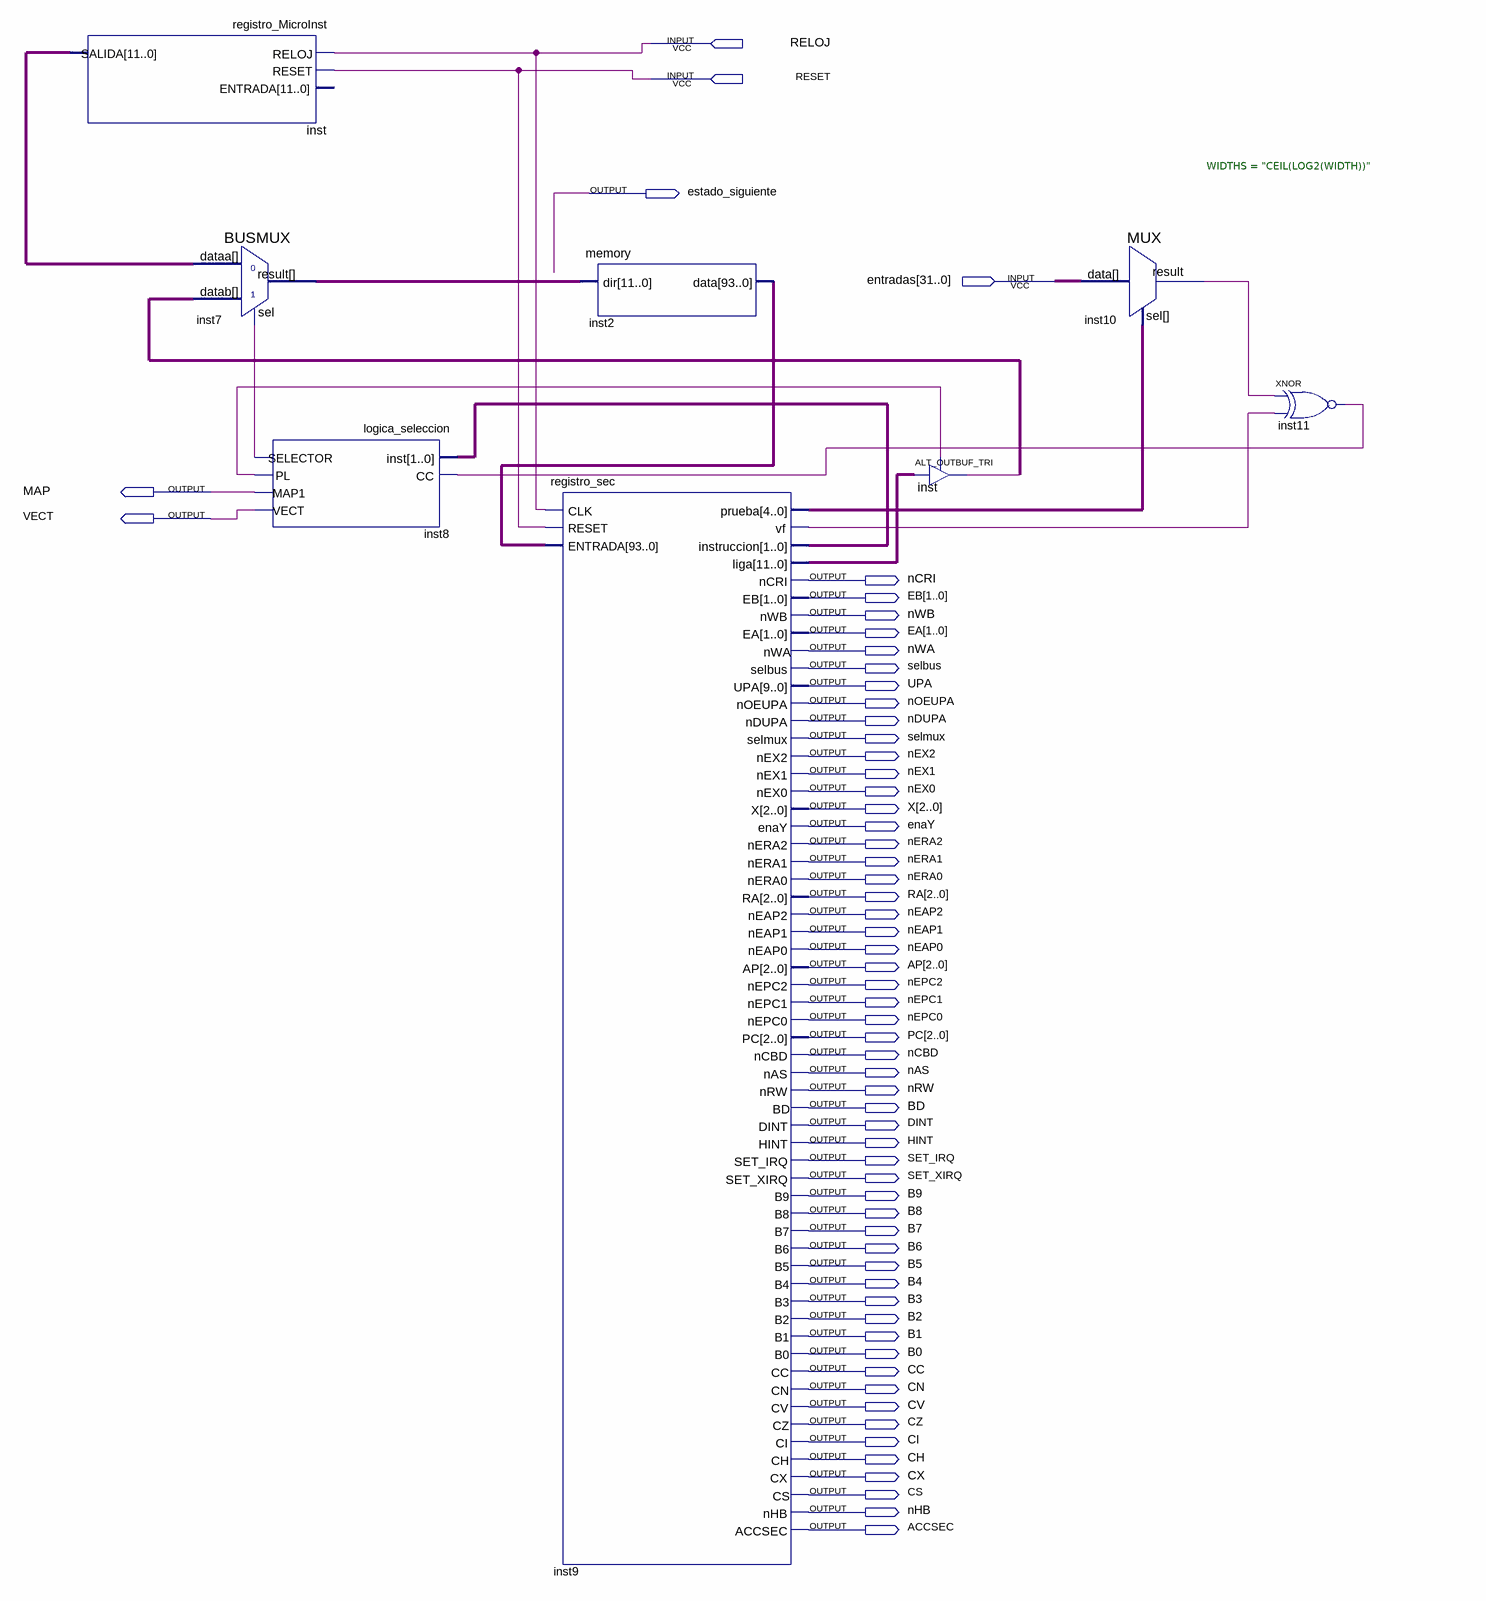
[diagram p0: schematic sheet]
// Quartus schematic secuenciador_basico.bdf as structural Verilog: 8 symbols, 61 pins
module secuenciador_basico (
  input  RELOJ,
  input  RESET,
  input  [31:0] entradas,
  output estado_siguiente,
  output MAP,
  output VECT,
  output nCRI,
  output [1:0] EB,
  output nWB,
  output [1:0] EA,
  output nWA,
  output selbus,
  output UPA,
  output nOEUPA,
  output nDUPA,
  output selmux,
  output nEX2,
  output nEX1,
  output nEX0,
  output [2:0] X,
  output enaY,
  output nERA2,
  output nERA1,
  output nERA0,
  output [2:0] RA,
  output nEAP2,
  output nEAP1,
  output nEAP0,
  output [2:0] AP,
  output nEPC2,
  output nEPC1,
  output nEPC0,
  output [2:0] PC,
  output nCBD,
  output nAS,
  output nRW,
  output BD,
  output DINT,
  output HINT,
  output SET_IRQ,
  output SET_XIRQ,
  output B9,
  output B8,
  output B7,
  output B6,
  output B5,
  output B4,
  output B3,
  output B2,
  output B1,
  output B0,
  output CC,
  output CN,
  output CV,
  output CZ,
  output CI,
  output CH,
  output CX,
  output CS,
  output nHB,
  output ACCSEC
);

  wire inst8_pl, inst8_selector, inst9_vf, inst10_result, inst11_out, inst_o;
  wire [1:0] inst9_instruccion;
  wire [4:0] inst9_prueba;
  wire [11:0] inst7_result, inst9_liga, inst_salida;
  wire [93:0] inst2_data;

  registro_MicroInst inst (.RELOJ(RELOJ), .RESET(RESET), .SALIDA(inst_salida));  // open: ENTRADA
  BUSMUX inst7 (.datab(inst_o), .sel(inst8_selector), .dataa(inst_salida), .result(inst7_result));
  logica_seleccion inst8 (
    .inst(inst9_instruccion), .CC(inst11_out), .SELECTOR(inst8_selector), .PL(inst8_pl), .MAP1(MAP),
    .VECT(VECT));
  memory inst2 (.dir(inst7_result), .data(inst2_data));
  registro_sec inst9 (
    .CLK(RELOJ), .RESET(RESET), .ENTRADA(inst2_data), .prueba(inst9_prueba), .vf(inst9_vf),
    .instruccion(inst9_instruccion), .liga(inst9_liga), .nCRI(nCRI), .EB(EB), .nWB(nWB), .EA(EA), .nWA(nWA),
    .selbus(selbus), .UPA(UPA), .nOEUPA(nOEUPA), .nDUPA(nDUPA), .selmux(selmux), .nEX2(nEX2), .nEX1(nEX1),
    .nEX0(nEX0), .X(X), .enaY(enaY), .nERA2(nERA2), .nERA1(nERA1), .nERA0(nERA0), .RA(RA), .nEAP2(nEAP2),
    .nEAP1(nEAP1), .nEAP0(nEAP0), .AP(AP), .nEPC2(nEPC2), .nEPC1(nEPC1), .nEPC0(nEPC0), .PC(PC), .nCBD(nCBD),
    .nAS(nAS), .nRW(nRW), .BD(BD), .DINT(DINT), .HINT(HINT), .SET_IRQ(SET_IRQ), .SET_XIRQ(SET_XIRQ), .B9(B9),
    .B8(B8), .B7(B7), .B6(B6), .B5(B5), .B4(B4), .B3(B3), .B2(B2), .B1(B1), .B0(B0), .CC(CC), .CN(CN),
    .CV(CV), .CZ(CZ), .CI(CI), .CH(CH), .CX(CX), .CS(CS), .nHB(nHB), .ACCSEC(ACCSEC));
  ALT_OUTBUF_TRI inst_dup2[11:0] (.i(inst9_liga), .oe(inst8_pl), .o(inst_o));
  MUX #(.WIDTHS("CEIL(LOG2(WIDTH))")) inst10 (.data(entradas), .sel(inst9_prueba), .result(inst10_result));
  xnor inst11 (inst11_out, inst10_result, inst9_vf);
endmodule
